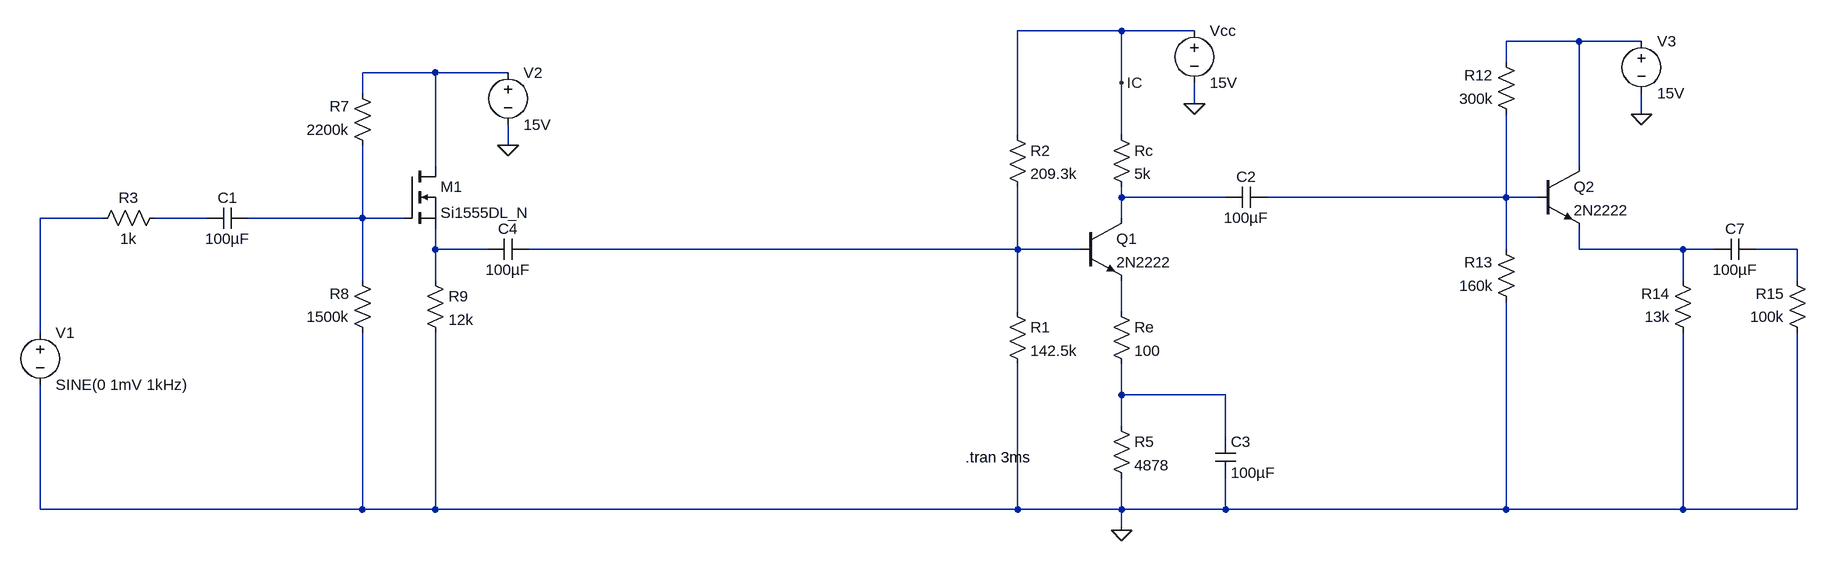
[diagram p0: schematic 3StageCircuit.asc]
3StageCircuit.asc, the LTspice schematic file:
Version 4
SHEET 1 2468 680
WIRE 1408 -144 1248 -144
WIRE 1520 -144 1408 -144
WIRE 2112 -128 2000 -128
WIRE 2208 -128 2112 -128
WIRE 2000 -96 2000 -128
WIRE 352 -80 240 -80
WIRE 464 -80 352 -80
WIRE 1408 -64 1408 -144
WIRE 240 -48 240 -80
WIRE 1520 -32 1520 -64
WIRE 2208 -16 2208 -48
WIRE 1248 16 1248 -144
WIRE 1408 16 1408 -64
WIRE 464 32 464 0
WIRE 352 64 352 -80
WIRE 2112 64 2112 -128
WIRE 1408 112 1408 96
WIRE 1568 112 1408 112
WIRE 2000 112 2000 -16
WIRE 2000 112 1632 112
WIRE 2048 112 2000 112
WIRE -160 144 -256 144
WIRE 0 144 -80 144
WIRE 240 144 240 32
WIRE 240 144 64 144
WIRE 304 144 240 144
WIRE 1408 144 1408 112
WIRE 352 192 352 160
WIRE 432 192 352 192
WIRE 1248 192 1248 96
WIRE 1248 192 496 192
WIRE 1344 192 1248 192
WIRE 2000 192 2000 112
WIRE 2112 192 2112 160
WIRE 2272 192 2112 192
WIRE 2320 192 2272 192
WIRE 2448 192 2384 192
WIRE 240 240 240 144
WIRE 352 240 352 192
WIRE 2272 240 2272 192
WIRE 2448 240 2448 192
WIRE 1248 288 1248 192
WIRE 1408 288 1408 240
WIRE -256 320 -256 144
WIRE 1408 416 1408 368
WIRE 1568 416 1408 416
WIRE 1408 464 1408 416
WIRE 1568 480 1568 416
WIRE -256 592 -256 400
WIRE 240 592 240 320
WIRE 240 592 -256 592
WIRE 352 592 352 320
WIRE 352 592 240 592
WIRE 1248 592 1248 368
WIRE 1248 592 352 592
WIRE 1408 592 1408 544
WIRE 1408 592 1248 592
WIRE 1568 592 1568 544
WIRE 1568 592 1408 592
WIRE 2000 592 2000 272
WIRE 2000 592 1568 592
WIRE 2272 592 2272 320
WIRE 2272 592 2000 592
WIRE 2448 592 2448 320
WIRE 2448 592 2272 592
WIRE 1408 624 1408 592
FLAG 1520 -32 0
FLAG 1408 -64 IC
FLAG 1408 624 0
FLAG 464 32 0
FLAG 2208 -16 0
SYMBOL res 1232 272 R0
SYMATTR InstName R1
SYMATTR Value 142.5k
SYMBOL res 1232 0 R0
SYMATTR InstName R2
SYMATTR Value 209.3k
SYMBOL res 1392 272 R0
SYMATTR InstName Re
SYMATTR Value 100
SYMBOL res 1392 0 R0
SYMATTR InstName Rc
SYMATTR Value 5k
SYMBOL npn 1344 144 R0
SYMATTR InstName Q1
SYMATTR Value 2N2222
SYMBOL voltage 1520 -160 R0
SYMATTR InstName Vcc
SYMATTR Value 15V
SYMBOL voltage -256 304 R0
WINDOW 123 0 0 Left 0
WINDOW 39 0 0 Left 0
SYMATTR InstName V1
SYMATTR Value SINE(0 1mV 1kHz)
SYMBOL cap 1632 96 R90
WINDOW 0 0 32 VBottom 2
WINDOW 3 32 32 VTop 2
SYMATTR InstName C2
SYMATTR Value 100µF
SYMBOL res -64 128 R90
WINDOW 0 0 56 VBottom 2
WINDOW 3 32 56 VTop 2
SYMATTR InstName R3
SYMATTR Value 1k
SYMBOL res 1392 448 R0
SYMATTR InstName R5
SYMATTR Value 4878
SYMBOL cap 1552 480 R0
SYMATTR InstName C3
SYMATTR Value 100µF
SYMBOL cap 64 128 R90
WINDOW 0 0 32 VBottom 2
WINDOW 3 32 32 VTop 2
SYMATTR InstName C1
SYMATTR Value 100µF
SYMBOL res 256 48 R180
WINDOW 0 36 76 Left 2
WINDOW 3 36 40 Left 2
SYMATTR InstName R7
SYMATTR Value 2200k
SYMBOL res 256 336 R180
WINDOW 0 36 76 Left 2
WINDOW 3 36 40 Left 2
SYMATTR InstName R8
SYMATTR Value 1500k
SYMBOL nmos 304 64 R0
SYMATTR InstName M1
SYMATTR Value Si1555DL_N
SYMBOL res 336 224 R0
SYMATTR InstName R9
SYMATTR Value 12k
SYMBOL cap 496 176 R90
WINDOW 0 0 32 VBottom 2
WINDOW 3 32 32 VTop 2
SYMATTR InstName C4
SYMATTR Value 100µF
SYMBOL res 2016 0 R180
WINDOW 0 36 76 Left 2
WINDOW 3 36 40 Left 2
SYMATTR InstName R12
SYMATTR Value 300k
SYMBOL res 2016 288 R180
WINDOW 0 36 76 Left 2
WINDOW 3 36 40 Left 2
SYMATTR InstName R13
SYMATTR Value 160k
SYMBOL res 2288 336 R180
WINDOW 0 36 76 Left 2
WINDOW 3 36 40 Left 2
SYMATTR InstName R14
SYMATTR Value 13k
SYMBOL res 2464 336 R180
WINDOW 0 36 76 Left 2
WINDOW 3 36 40 Left 2
SYMATTR InstName R15
SYMATTR Value 100k
SYMBOL cap 2384 176 R90
WINDOW 0 0 32 VBottom 2
WINDOW 3 32 32 VTop 2
SYMATTR InstName C7
SYMATTR Value 100µF
SYMBOL npn 2048 64 R0
SYMATTR InstName Q2
SYMATTR Value 2N2222
SYMBOL voltage 464 -96 R0
SYMATTR InstName V2
SYMATTR Value 15V
SYMBOL voltage 2208 -144 R0
SYMATTR InstName V3
SYMATTR Value 15V
TEXT 1168 512 Left 2 !.tran 3ms

The netlist it stands for:
* 3StageCircuit.asc
R1 N009 0 142.5k
R2 IC N009 209.3k
Re N012 N013 100
Rc IC N003 5k
Q1 N003 N009 N012 0 2N2222
Vcc IC 0 15V
V1 N005 0 SINE(0 1mV 1kHz)
C2 N004 N003 100µF
R3 N006 N005 1k
R5 N013 0 4878
C3 N013 0 100µF
C1 N007 N006 100µF
R7 N007 N002 2200k
R8 0 N007 1500k
M1 N002 N007 N008 N008 Si1555DL_N
R9 N008 0 12k
C4 N009 N008 100µF
R12 N004 N001 300k
R13 0 N004 160k
R14 0 N010 13k
R15 0 N011 100k
C7 N011 N010 100µF
Q2 N001 N004 N010 0 2N2222
V2 N002 0 15V
V3 N001 0 15V
.model NPN NPN
.model PNP PNP
.lib standard.bjt
.model NMOS NMOS
.model PMOS PMOS
.lib standard.mos
.tran 3ms
.backanno
.end